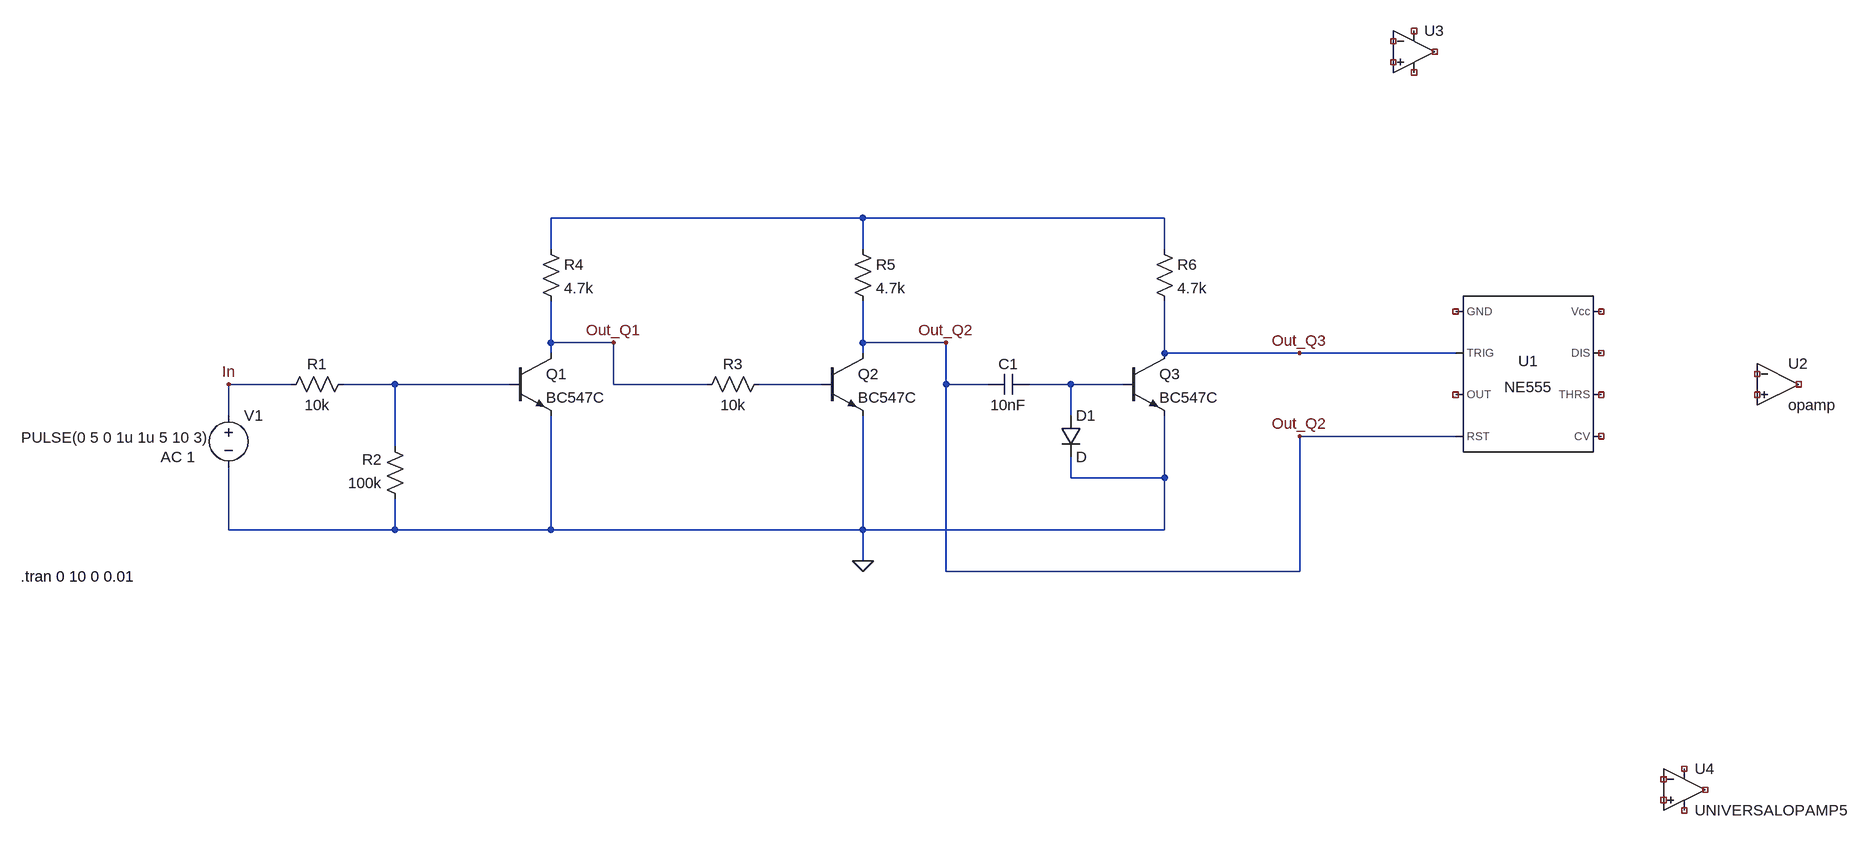
[diagram p0: schematic transistortrap + 555 ADSR.asc]
transistortrap + 555 ADSR.asc, the LTspice schematic file:
Version 4.1
SHEET 1 2200 856
WIRE 400 -64 -80 -64
WIRE 864 -64 400 -64
WIRE -80 -16 -80 -64
WIRE 400 -16 400 -64
WIRE 864 -16 864 -64
WIRE -80 128 -80 64
WIRE 16 128 -80 128
WIRE 400 128 400 64
WIRE 528 128 400 128
WIRE -80 144 -80 128
WIRE 400 144 400 128
WIRE 864 144 864 64
WIRE 1072 144 864 144
WIRE 1312 144 1072 144
WIRE -480 192 -576 192
WIRE -320 192 -400 192
WIRE -144 192 -320 192
WIRE 16 192 16 128
WIRE 160 192 16 192
WIRE 336 192 240 192
WIRE 528 192 528 128
WIRE 592 192 528 192
WIRE 720 192 656 192
WIRE 800 192 720 192
WIRE -576 240 -576 192
WIRE 720 240 720 192
WIRE 1312 272 1072 272
WIRE -320 288 -320 192
WIRE 720 336 720 304
WIRE 864 336 864 240
WIRE 864 336 720 336
WIRE -576 416 -576 320
WIRE -320 416 -320 368
WIRE -320 416 -576 416
WIRE -80 416 -80 240
WIRE -80 416 -320 416
WIRE 400 416 400 240
WIRE 400 416 -80 416
WIRE 864 416 864 336
WIRE 864 416 400 416
WIRE 400 464 400 416
WIRE 528 480 528 192
WIRE 1072 480 1072 272
WIRE 1072 480 528 480
FLAG 400 464 0
FLAG -576 192 In
FLAG 16 128 Out_Q1
FLAG 528 128 Out_Q2
FLAG 1072 144 Out_Q3
FLAG 1072 272 Out_Q2
SYMBOL npn -144 144 R0
SYMATTR InstName Q1
SYMATTR Value BC547C
SYMBOL npn 336 144 R0
SYMATTR InstName Q2
SYMATTR Value BC547C
SYMBOL npn 800 144 R0
SYMATTR InstName Q3
SYMATTR Value BC547C
SYMBOL res -384 176 R90
WINDOW 0 0 56 VBottom 2
WINDOW 3 32 56 VTop 2
SYMATTR InstName R1
SYMATTR Value 10k
SYMBOL res -304 384 R180
WINDOW 0 36 76 Left 2
WINDOW 3 36 40 Left 2
SYMATTR InstName R2
SYMATTR Value 100k
SYMBOL res 144 208 R270
WINDOW 0 32 56 VTop 2
WINDOW 3 0 56 VBottom 2
SYMATTR InstName R3
SYMATTR Value 10k
SYMBOL res -96 -32 R0
SYMATTR InstName R4
SYMATTR Value 4.7k
SYMBOL res 384 -32 R0
SYMATTR InstName R5
SYMATTR Value 4.7k
SYMBOL res 848 -32 R0
SYMATTR InstName R6
SYMATTR Value 4.7k
SYMBOL cap 656 176 R90
WINDOW 0 0 32 VBottom 2
WINDOW 3 32 32 VTop 2
SYMATTR InstName C1
SYMATTR Value 10nF
SYMBOL diode 704 240 R0
SYMATTR InstName D1
SYMBOL voltage -576 224 R0
WINDOW 3 -319 50 Left 2
WINDOW 123 -105 80 Left 2
WINDOW 39 0 0 Left 0
SYMATTR InstName V1
SYMATTR Value PULSE(0 5 0 1u 1u 5 10 3)
SYMATTR Value2 AC 1
SYMBOL Misc\\NE555 1424 176 R0
SYMATTR InstName U1
SYMBOL OpAmps\\opamp 1808 128 R0
SYMATTR InstName U2
SYMBOL OpAmps\\UniversalOpAmp 1248 -320 R0
SYMATTR InstName U3
SYMBOL OpAmps\\UniversalOpAmp5 1664 816 R0
SYMATTR InstName U4
TEXT -896 488 Left 2 !.tran 0 10 0 0.01

The netlist it stands for:
* transistortrap + 555 ADSR.asc
Q1 Out_Q1 N002 0 0 BC547C
Q2 Out_Q2 N003 0 0 BC547C
Q3 Out_Q3 N004 0 0 BC547C
R1 N002 In 10k
R2 0 N002 100k
R3 Out_Q1 N003 10k
R4 N001 Out_Q1 4.7k
R5 N001 Out_Q2 4.7k
R6 N001 Out_Q3 4.7k
C1 N004 Out_Q2 10nF
D1 N004 0 D
V1 In 0 PULSE(0 5 0 1u 1u 5 10 3) AC 1
X§U1 NC_01 Out_Q3 NC_02 Out_Q2 NC_03 NC_04 NC_05 NC_06 NE555  ; pins GND TRIG OUT RST CV THRS DIS Vcc
X§U2 NC_07 NC_08 NC_09 opamp Aol=100K GBW=10Meg  ; pins invin noninvin out
X§U3 NC_10 NC_11 NC_12 NC_13 NC_14 level1 Avol=1Meg GBW=10Meg Vos=0 En=0 Enk=0 In=0 Ink=0 Rin=500Meg  ; pins In+ In- V+ V- OUT
X§U4 NC_15 NC_16 NC_17 NC_18 NC_19 level5 Avol=1Meg GBW=10Meg Phimargin=45 SlewPos=10Meg SlewNeg=10Meg En=0 Enk=0 In=0 Ink=0 Rcm=500Meg Ccm=1p Rdiff=500k Cdiff=2p Ro=1k Vos=0 Ibp=2n Ibn=1n Iq=1m Rail=0 Ilimit=25m  ; UNIVERSALOPAMP5, pins In+ In- V+ V- OUT
.model D D
.lib standard.dio
.model NPN NPN
.model PNP PNP
.lib standard.bjt
.tran 0 10 0 0.01
.lib NE555.sub
.lib UniversalOpAmp1.lib
.backanno
.end